# EAGLE design SDBoard_for_CX80 (EAGLE 6.3)
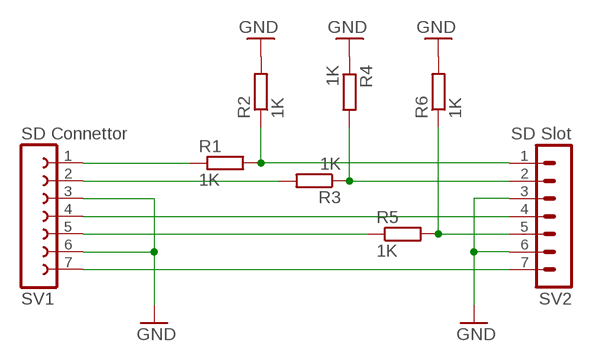
[diagram p0: schematic, sheet 1]

## Parts
R1  1K  R-EU_0207/12  [0207/12]
R2  1K  R-EU_0207/12  [0207/12]
R3  1K  R-EU_0207/12  [0207/12]
R4  1K  R-EU_0207/12  [0207/12]
R5  1K  R-EU_0207/12  [0207/12]
R6  1K  R-EU_0207/12  [0207/12]
SV1  SD Connettor  FE07-1  [FE07]
SV2  SD Slot  MA07-1  [MA07-1]

## Nets
GND: R2.2 R4.1 R6.2 SV1.3 SV1.6 SV2.3 SV2.6
N$1: R1.1 SV1.1
N$2: R1.2 R2.1 SV2.1
N$3: R3.2 SV1.2
N$4: R3.1 R4.2 SV2.2
N$5: R5.1 SV1.5
N$6: R5.2 R6.1 SV2.5
N$7: SV1.4 SV2.4
N$8: SV1.7 SV2.7

## Library data of the parts
R1-R6 = resistor:R-EU_: RESISTOR, European symbol
SV1 = con-lsta:FE07-1: FEMALE HEADER; OC_FARNELL: unknown; OC_NEWARK: unknown
SV2 = con-lstb:MA07-1: PIN HEADER; OC_FARNELL: unknown; OC_NEWARK: unknown

## Board
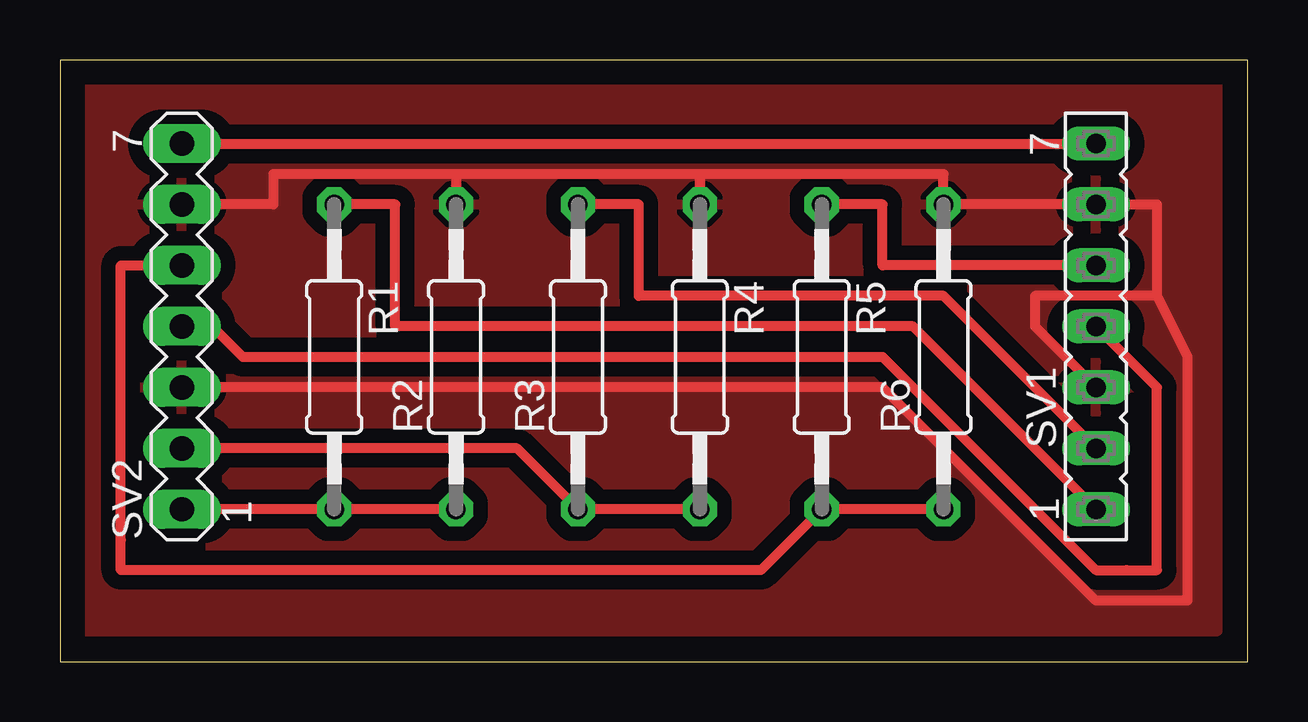
[diagram p1: board, top side]

Size 49.51 x 25.07 mm. Coordinates in mm from the lower left corner, seen from the top.
Outline: 0,0 49.51,0 49.51,25.07 0,25.07 0,0
Copper layers (1*16): Top 0.035mm / dielectric 1.5mm / Bottom 0.035mm
Design rules "default *": minimum track width 16mil, minimum drill 24mil, track to track 12mil, track to pad 12mil, pad to pad 8mil, via to via 8mil, smd to smd 8mil, copper to edge 40mil, drill to drill 8mil, minimum pad ring 12mil, minimum via ring 8mil, stop-mask expansion 4mil, vias tented up to drill 0mil, thermal gap 10mil

### Footprints (pad centres in the part's own frame; a part is rotated, then mirrored left to right if it is on the bottom)
0207/12 = drill 0.813 octagon: 1 -6.35,0; 2 6.35,0
FE07 = drill 0.813 long: 1 -7.62,0; 2 -5.08,0; 3 -2.54,0; 4 0,0; 5 2.54,0; 6 5.08,0; 7 7.62,0
MA07-1 = drill 1.016 long: 1 -7.62,0; 2 -5.08,0; 3 -2.54,0; 4 0,0; 5 2.54,0; 6 5.08,0; 7 7.62,0

### Placement (x,y rotation side)
R1  11.43,12.7 270 top
R2  16.51,12.7 90 top
R3  21.59,12.7 90 top
R4  26.67,12.7 270 top
R5  31.75,12.7 270 top
R6  36.83,12.7 90 top
SV1  43.18,13.97 90 top
SV2  5.08,13.97 90 top

### Tracks (layer width: path | path; a pad name or v marks a point on that pad's centre or on a via)
GND
  Top 0.406: 16.51,20.32 R2.2 | 26.67,20.32 16.51,20.32 | 26.67,20.32 R4.1 26.67,20.32 | SV2.6 8.89,19.05 8.89,20.32 16.51,20.32 | SV1.3 40.64,13.97 40.64,15.24 45.72,15.24 | 45.72,15.24 45.72,19.05 SV1.6 R6.2 36.83,20.32 30.48,20.32 26.67,20.32 | SV2.3 34.29,11.43 43.18,2.54 46.99,2.54 46.99,6.35 46.99,12.7 45.72,15.24
  pour Top (isolate 0.61): 0,25.4 0,1.27 48.26,1.27 48.26,25.4
N$1
  Top 0.406: R1.1 13.97,19.05 13.97,13.97 35.56,13.97 SV1.1
N$2
  Top 0.406: R2.1 R1.2 SV2.1
N$3
  Top 0.406: R3.2 24.13,19.05 24.13,15.24 36.83,15.24 SV1.2
N$4
  Top 0.406: R4.2 R3.1 19.05,8.89 SV2.2
N$5
  Top 0.406: R5.1 34.29,19.05 34.29,16.51 SV1.5
N$6
  Top 0.406: R6.1 R5.2 29.21,3.81 2.54,3.81 2.54,5.08 2.54,16.51 3.81,16.51 SV2.5
N$7
  Top 0.406: SV1.4 45.72,11.43 45.72,3.81 44.45,3.81 43.18,3.81 34.29,12.7 7.62,12.7 6.35,13.97 SV2.4
N$8
  Top 0.406: SV2.7 SV1.7